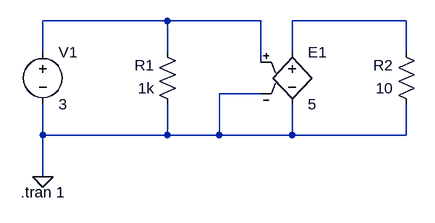
[diagram p0: schematic aula03.asc]
aula03.asc, the LTspice schematic file:
Version 4
SHEET 1 880 680
WIRE -48 -48 -240 -48
WIRE 96 -48 -48 -48
WIRE 320 -48 144 -48
WIRE -240 0 -240 -48
WIRE -48 0 -48 -48
WIRE 144 0 144 -48
WIRE 320 0 320 -48
WIRE 96 16 96 -48
WIRE 96 64 32 64
WIRE -240 128 -240 80
WIRE -48 128 -48 80
WIRE -48 128 -240 128
WIRE 32 128 32 64
WIRE 32 128 -48 128
WIRE 144 128 144 80
WIRE 144 128 32 128
WIRE 320 128 320 80
WIRE 320 128 144 128
WIRE -240 192 -240 128
FLAG -240 192 0
SYMBOL e 144 -16 R0
SYMATTR InstName E1
SYMATTR Value 5
SYMBOL voltage -240 -16 R0
WINDOW 123 0 0 Left 0
WINDOW 39 0 0 Left 0
SYMATTR InstName V1
SYMATTR Value 3
SYMBOL res -32 96 R180
WINDOW 0 36 76 Left 2
WINDOW 3 36 40 Left 2
SYMATTR InstName R1
SYMATTR Value 1k
SYMBOL res 336 96 R180
WINDOW 0 36 76 Left 2
WINDOW 3 36 40 Left 2
SYMATTR InstName R2
SYMATTR Value 10
TEXT -274 216 Left 2 !.tran 1

The netlist it stands for:
* aula03.asc
E1 N002 0 N001 0 5
V1 N001 0 3
R1 0 N001 1k
R2 0 N002 10
.tran 1
.backanno
.end